# Altium project RF to UART.PrjPcb
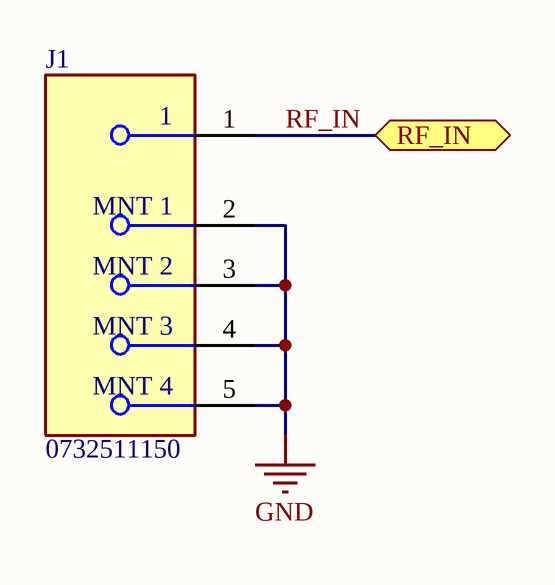
[diagram p0: Connectors.SchDoc]
1 sheet, 1 parts. Net scope: flat (ports and power ports of the same name join across sheets).

## Sheet Connectors.SchDoc
size A; SheetNumber: 1; SheetTotal: 1

### Parts
J1  0732511150  [FP-0732511150-MFG]

### Ports
RF_IN (bidir)

### Nets
GND: J1.2(MNT_1) J1.3(MNT_2) J1.4(MNT_3) J1.5(MNT_4)
RF_IN: J1.1 ; port RF_IN

### Library data of the parts
J1 = CMP-04764-000001-1: CONN SMA RCPT STR 50OHM EDGE MNT; Manufacturer: Molex Inc; Voltage Rating: 500V; Description: RF/COAXIAL SMA JACK STR 50OHM EDGE MOUNT; Is Female: yes; Impedance: 50Ω; Conn Orientation: Horizontal; Dielectric Material: PTFE; Frequency: 18GHz; Shielding: true; Number Of Contacts: 1; Temperature: -65°C to +165°C; Device Class L2: RF / Coaxial Connectors; Contact Material: Gold,Nickel; RoHS: TRUE; ComponentLink2Description: Datasheet; Digikey Description: CONN SMA RCPT STR 50OHM EDGE MNT; Category: Conn; Package: 0; Device Class L1: Connectors; Manufacturer Part Number: 0732511150; Temperature Range High: +165°C; Mouser Description: RF Connectors / Coaxial Connectors SMA ST PCB-JCK STD EMT; Footprint Url: https://www.molex.com/pdm_docs/sd/732511150_sd.pdf; Octopart: https://octopart.com/73251-1150-molex-777272; Automotive: No; Lead Free: Yes; Temperature Range Low: -65°C; ComponentLink2URL: https://www.molex.com/webdocs/datasheets/pdf/en-us/0732511150_RF_COAX_CONNECTORS.pdf; Device Class L3: unset; Supplier 1: Arrow Electronics; Supplier Part Number 1: 73251-1150